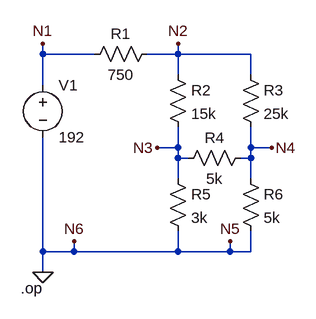
[diagram p0: schematic P_3-49.asc]
P_3-49.asc, the LTspice schematic file:
Version 4
SHEET 1 880 680
WIRE -64 96 -64 80
WIRE 16 96 -64 96
WIRE 144 96 144 80
WIRE 144 96 96 96
WIRE 256 96 144 96
WIRE 144 128 144 96
WIRE 256 128 256 96
WIRE -64 144 -64 96
WIRE 144 240 144 208
WIRE 144 240 112 240
WIRE 256 240 256 208
WIRE 288 240 256 240
WIRE 144 256 144 240
WIRE 160 256 144 256
WIRE 256 256 256 240
WIRE 256 256 240 256
WIRE 144 288 144 256
WIRE 256 288 256 256
WIRE -64 400 -64 224
WIRE -16 400 -16 384
WIRE -16 400 -64 400
WIRE 144 400 144 368
WIRE 144 400 -16 400
WIRE 224 400 224 384
WIRE 224 400 144 400
WIRE 256 400 256 368
WIRE 256 400 224 400
WIRE -64 432 -64 400
FLAG -64 432 0
FLAG -64 80 N1
FLAG 144 80 N2
FLAG 112 240 N3
FLAG 288 240 N4
FLAG 224 384 N5
FLAG -16 384 N6
SYMBOL voltage -64 128 R0
WINDOW 123 0 0 Left 2
WINDOW 39 0 0 Left 2
SYMATTR InstName V1
SYMATTR Value 192
SYMBOL res 0 112 R270
WINDOW 0 32 56 VTop 2
WINDOW 3 0 56 VBottom 2
SYMATTR InstName R1
SYMATTR Value 750
SYMBOL res 128 112 R0
SYMATTR InstName R2
SYMATTR Value 15k
SYMBOL res 240 112 R0
SYMATTR InstName R3
SYMATTR Value 25k
SYMBOL res 144 272 R270
WINDOW 0 32 56 VTop 2
WINDOW 3 0 56 VBottom 2
SYMATTR InstName R4
SYMATTR Value 5k
SYMBOL res 128 272 R0
SYMATTR InstName R5
SYMATTR Value 3k
SYMBOL res 240 272 R0
SYMATTR InstName R6
SYMATTR Value 5k
TEXT -98 456 Left 2 !.op

The netlist it stands for:
* P_3-49.asc
V1 N1 0 192
R1 N1 N2 750
R2 N2 N3 15k
R3 N2 N4 25k
R4 N3 N4 5k
R5 N3 0 3k
R6 N4 0 5k
.op
.backanno
.end

* Results of the author's LTspice run, read from the files saved beside the schematic
* Operating Point:
*   V(n1) = 192 V
*   V(n2) = 180 V
*   V(n3) = 30 V
*   V(n4) = 30 V
*   I(R6) = 6 mA
*   I(R5) = 10 mA
*   I(R4) = 0 A
*   I(R3) = 6 mA
*   I(R2) = 10 mA
*   I(R1) = 16 mA
*   I(V1) = -16 mA